# EAGLE schematic Brainb (EAGLE 6.1)
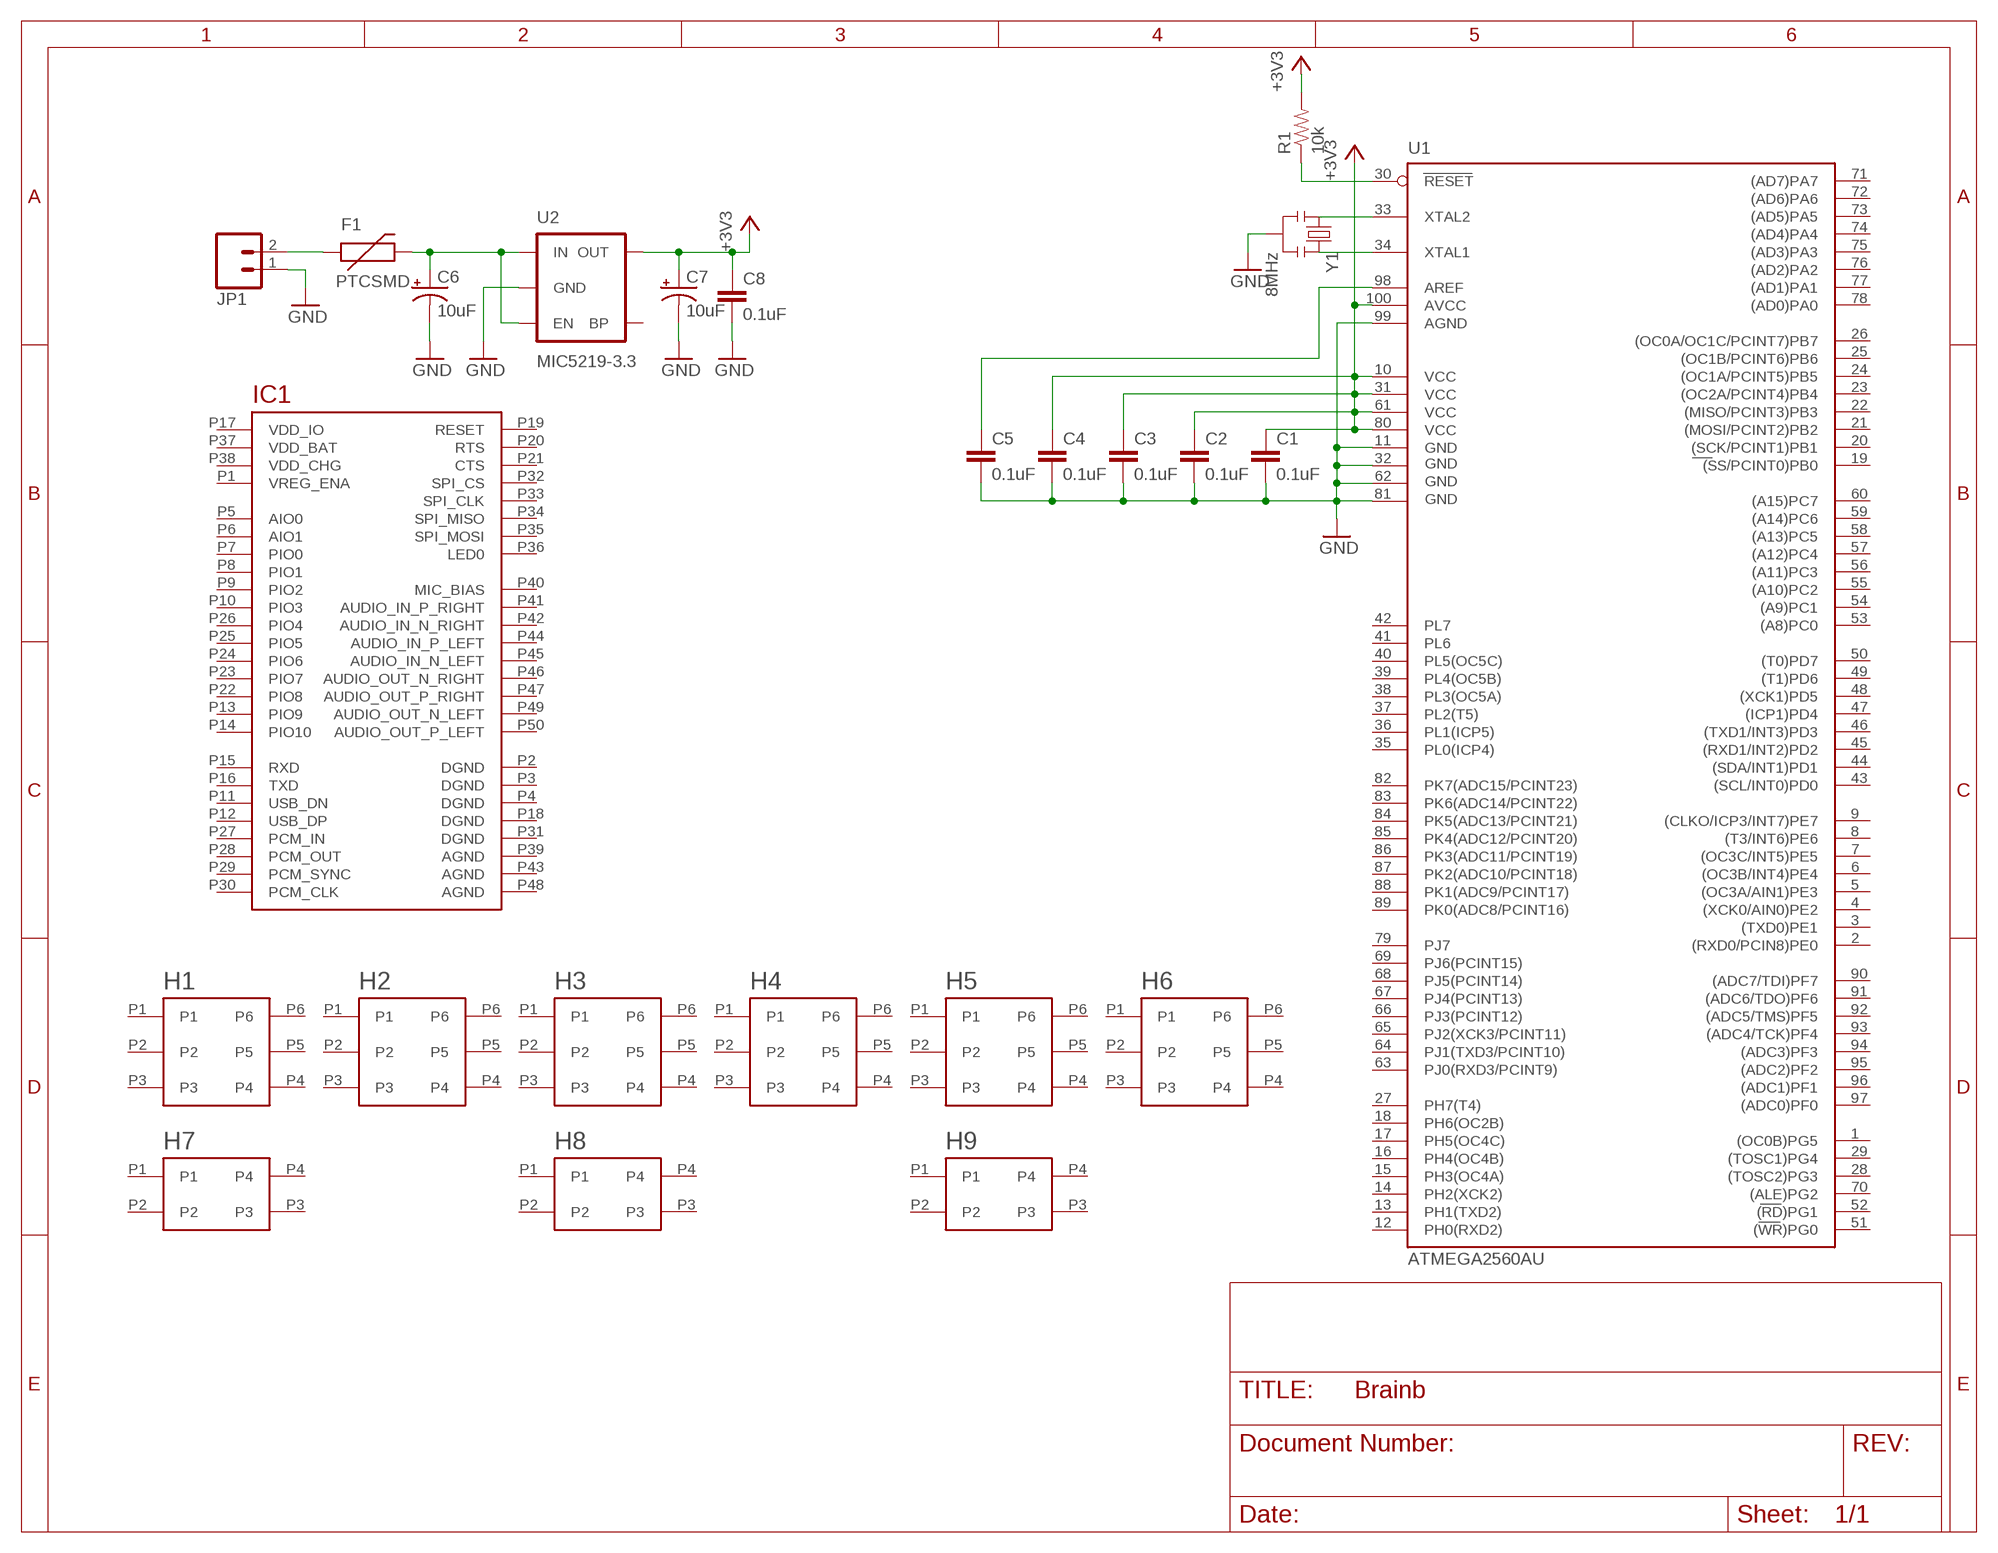
[diagram p0: schematic, sheet 1]

## Parts
C1  0.1uF  CAP0603-CAP  [0603-CAP]
C2  0.1uF  CAP0603-CAP  [0603-CAP]
C3  0.1uF  CAP0603-CAP  [0603-CAP]
C4  0.1uF  CAP0603-CAP  [0603-CAP]
C5  0.1uF  CAP0603-CAP  [0603-CAP]
C6  10uF  CAP_POL1206  [EIA3216]
C7  10uF  CAP_POL1206  [EIA3216]
C8  0.1uF  CAP0603-CAP  [0603-CAP]
F1  PTCSMD  [PTC-1206]
H1  3X2F_1MM_SMD  [3X2F_1MM_SMD]
H2  3X2F_1MM_SMD  [3X2F_1MM_SMD]
H3  3X2F_1MM_SMD  [3X2F_1MM_SMD]
H4  3X2F_1MM_SMD  [3X2F_1MM_SMD]
H5  3X2F_1MM_SMD  [3X2F_1MM_SMD]
H6  3X2F_1MM_SMD  [3X2F_1MM_SMD]
H7  2X2F_1MM_SMD  [2X2F_1MM_SMD]
H8  2X2F_1MM_SMD  [2X2F_1MM_SMD]
H9  2X2F_1MM_SMD  [2X2F_1MM_SMD]
IC1  WT32WT32  [WT32]
JP1  M02-JST-2MM-SMT  [JST-2-SMD]
R1  10k  RESISTOR0603-RES  [0603-RES]
U1  ATMEGA2560AU  [TQFP100]
U2  MIC5219-3.3  V_REG_MIC5219SMD  [SOT23-5]
Y1  8MHz  RESONATORSMD  [RESONATOR-SMD]

## Nets
+3V3: C1.1 C2.1 C3.1 C4.1 C7.A(+) C8.1 R1.2 U1.10(VCC) U1.31(VCC1) U1.61(VCC2) U1.80(VCC3) U1.100(AVCC) U2.5(OUT)
GND: C1.2 C2.2 C3.2 C4.2 C5.2 C6.C(-) C7.C(-) C8.2 JP1.1 U1.11(GND) U1.32(GND1) U1.62(GND2) U1.81(GND3) U1.99(AGND) U2.2(GND) Y1.2
N$1: C5.1 U1.98(AREF)
N$2: U1.34(XTAL1) Y1.3
N$3: U1.33(XTAL2) Y1.1
N$4: F1.1 JP1.2
N$5: R1.1 U1.30(RESET)
N$6: C6.A(+) F1.2 U2.1(IN) U2.3(EN)
Unconnected: H1.P1 H1.P2 H1.P3 H1.P4 H1.P5 H1.P6 H2.P1 H2.P2 H2.P3 H2.P4 H2.P5 H2.P6 H3.P1 H3.P2 H3.P3 H3.P4 H3.P5 H3.P6 H4.P1 H4.P2 H4.P3 H4.P4 H4.P5 H4.P6 H5.P1 H5.P2 H5.P3 H5.P4 H5.P5 H5.P6 H6.P1 H6.P2 H6.P3 H6.P4 H6.P5 H6.P6 H7.P1 H7.P2 H7.P3 H7.P4 H8.P1 H8.P2 H8.P3 H8.P4 H9.P1 H9.P2 H9.P3 H9.P4 IC1.P1(VREG_ENA) IC1.P2(DGND) IC1.P3(DGND) IC1.P4(DGND) IC1.P5(AIO0) IC1.P6(AIO1) IC1.P7(PIO0) IC1.P8(PIO1) IC1.P9(PIO2) IC1.P10(PIO3) IC1.P11(USB_DN) IC1.P12(USB_DP) IC1.P13(PIO9) IC1.P14(PIO10) IC1.P15(RXD) IC1.P16(TXD) IC1.P17(VDD_IO) IC1.P18(DGND) IC1.P19(RESET) IC1.P20(RTS) IC1.P21(CTS) IC1.P22(PIO8) IC1.P23(PIO7) IC1.P24(PIO6) IC1.P25(PIO5) IC1.P26(PIO4) IC1.P27(PCM_IN) IC1.P28(PCM_OUT) IC1.P29(PCM_SYNC) IC1.P30(PCM_CLK) IC1.P31(DGND) IC1.P32(SPI_CS) IC1.P33(SPI_CLK) IC1.P34(SPI_MISO) IC1.P35(SPI_MOSI) IC1.P36(LED0) IC1.P37(VDD_BAT) IC1.P38(VDD_CHG) IC1.P39(AGND) IC1.P40(MIC_BIAS) IC1.P41(AUDIO_IN_P_RIGHT) IC1.P42(AUDIO_IN_N_RIGHT) IC1.P43(AGND) IC1.P44(AUDIO_IN_P_LEFT) IC1.P45(AUDIO_IN_N_LEFT) IC1.P46(AUDIO_OUT_N_RIGHT) IC1.P47(AUDIO_OUT_P_RIGHT) IC1.P48(AGND) IC1.P49(AUDIO_OUT_N_LEFT) IC1.P50(AUDIO_OUT_P_LEFT) U1.1((OC0B)PG5) U1.2((RXD0/PCIN8)PE0) U1.3((TXD0)PE1) U1.4((XCK0/AIN0)PE2) U1.5((OC3A/AIN1)PE3) U1.6((OC3B/INT4)PE4) U1.7((OC3C/INT5)PE5) U1.8((T3/INT6)PE6) U1.9((CLKO/ICP3/INT7)PE7) U1.12(PH0(RXD2)) U1.13(PH1(TXD2)) U1.14(PH2(XCK2)) U1.15(PH3(OC4A)) U1.16(PH4(OC4B)) U1.17(PH5(OC4C)) U1.18(PH6(OC2B)) U1.19((SS/PCINT0)PB0) U1.20((SCK/PCINT1)PB1) U1.21((MOSI/PCINT2)PB2) U1.22((MISO/PCINT3)PB3) U1.23((OC2A/PCINT4)PB4) U1.24((OC1A/PCINT5)PB5) U1.25((OC1B/PCINT6)PB6) U1.26((OC0A/OC1C/PCINT7)PB7) U1.27(PH7(T4)) U1.28((TOSC2)PG3) U1.29((TOSC1)PG4) U1.35(PL0(ICP4)) U1.36(PL1(ICP5)) U1.37(PL2(T5)) U1.38(PL3(OC5A)) U1.39(PL4(OC5B)) U1.40(PL5(OC5C)) U1.41(PL6) U1.42(PL7) U1.43((SCL/INT0)PD0) U1.44((SDA/INT1)PD1) U1.45((RXD1/INT2)PD2) U1.46((TXD1/INT3)PD3) U1.47((ICP1)PD4) U1.48((XCK1)PD5) U1.49((T1)PD6) U1.50((T0)PD7) U1.51((WR)PG0) U1.52((RD)PG1) U1.53((A8)PC0) U1.54((A9)PC1) U1.55((A10)PC2) U1.56((A11)PC3) U1.57((A12)PC4) U1.58((A13)PC5) U1.59((A14)PC6) U1.60((A15)PC7) U1.63(PJ0(RXD3/PCINT9)) U1.64(PJ1(TXD3/PCINT10)) U1.65(PJ2(XCK3/PCINT11)) U1.66(PJ3(PCINT12)) U1.67(PJ4(PCINT13)) U1.68(PJ5(PCINT14)) U1.69(PJ6(PCINT15)) U1.70((ALE)PG2) U1.71((AD7)PA7) U1.72((AD6)PA6) U1.73((AD5)PA5) U1.74((AD4)PA4) U1.75((AD3)PA3) U1.76((AD2)PA2) U1.77((AD1)PA1) U1.78((AD0)PA0) U1.79(PJ7) U1.82(PK7(ADC15/PCINT23)) U1.83(PK6(ADC14/PCINT22)) U1.84(PK5(ADC13/PCINT21)) U1.85(PK4(ADC12/PCINT20)) U1.86(PK3(ADC11/PCINT19)) U1.87(PK2(ADC10/PCINT18)) U1.88(PK1(ADC9/PCINT17)) U1.89(PK0(ADC8/PCINT16)) U1.90((ADC7/TDI)PF7) U1.91((ADC6/TDO)PF6) U1.92((ADC5/TMS)PF5) U1.93((ADC4/TCK)PF4) U1.94((ADC3)PF3) U1.95((ADC2)PF2) U1.96((ADC1)PF1) U1.97((ADC0)PF0) U2.4(BP)

## Library data of the parts
C1-C5 C8 = SparkFun-Passives:CAP: Capacitor Standard 0603 ceramic capacitor, and 0.1" leaded capacitor.
C6 C7 = SparkFun-Passives:CAP_POL: Capacitor Polarized These are standard SMD and PTH capacitors. Normally 10uF, 47uF, and 100uF in electrolytic and tantalum varieties. Always verify the external diameter of the through hole cap, it varies with capacity, voltage, and manufacturer. The EIA devices should be standard.
F1 = SparkFun-PowerIC:PTC: Resettable Fuse PTC Resettable Fuse. Spark Fun Electronics SKU : COM-08357
H1-H6 = Customs:3X2
H7-H9 = Customs:2X2
IC1 = Customs:WT32
JP1 = SparkFun-Connectors:M02: Header 2 Standard 2-pin 0.1" header. Use with straight break away headers (SKU : PRT-00116), right angle break away headers (PRT-00553), swiss pins (PRT-00743), machine pins (PRT-00117), and female headers (PRT-00115). Molex polarized connector foot print use with SKU : PRT-08233 with associated crimp pins and housings.
R1 = SparkFun-Passives:RESISTOR: Resistor Basic schematic elements and footprints for 0603, 1206, and PTH resistors.
U1 = SparkFun-DigitalIC:ATMEGA2560: Atmel 100-pin 8-bit uC 64/128/256 Kbytes FLASH 4 Kbytes EEPROM 8 Kbytes SRAM 86 General Purpose I/O pins 12-channels16-bit PWM 4 x Serial USARTs 16-channels 10-bit A/D
U2 = SparkFun-PowerIC:V_REG_MIC5219: V_REG MIC5219 Standard 500mA LDO voltage regulator in SOT-23 layout. Micrel part MIC5219. BP (by-pass) pin is used to lower output noise with 470pF cap, may be left open.
Y1 = SparkFun-FreqCtrl:RESONATOR: Resonator Small SMD resonator. This is the itty bitty 10/20MHz resonators with built in caps. CSTCE10M0G55 and CSTCE20M0V53. Footprint has been reviewed closely but hasn't been tested yet.